# Altium schematic sheet PDM.SchDoc
size A4; SheetNumber: 16; SheetTotal: 17
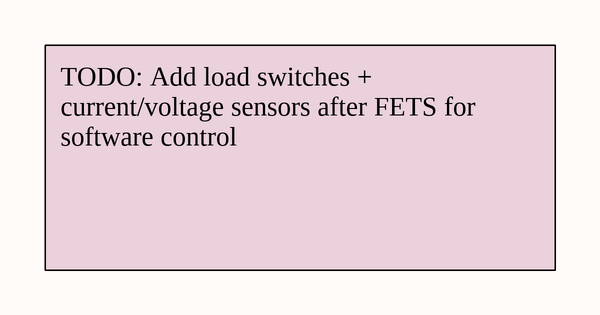
[diagram p0: PDM.SchDoc]

## Notes on the sheet
- TODO: Add load switches + current/voltage sensors after FETS for software control